# EasyEDA Pro project mykeyboard.epro

# Schematic Schematic1

## Sheets
1 P1: Board Name: Board1; Create Date: 2025-10-04; Page Name: P1; Project Name: mykeyboard; Schematic Name: Schematic1; Update Date: 2025-10-05; Company: 嘉立创EDA; Page Size: A4; Version: V1.0
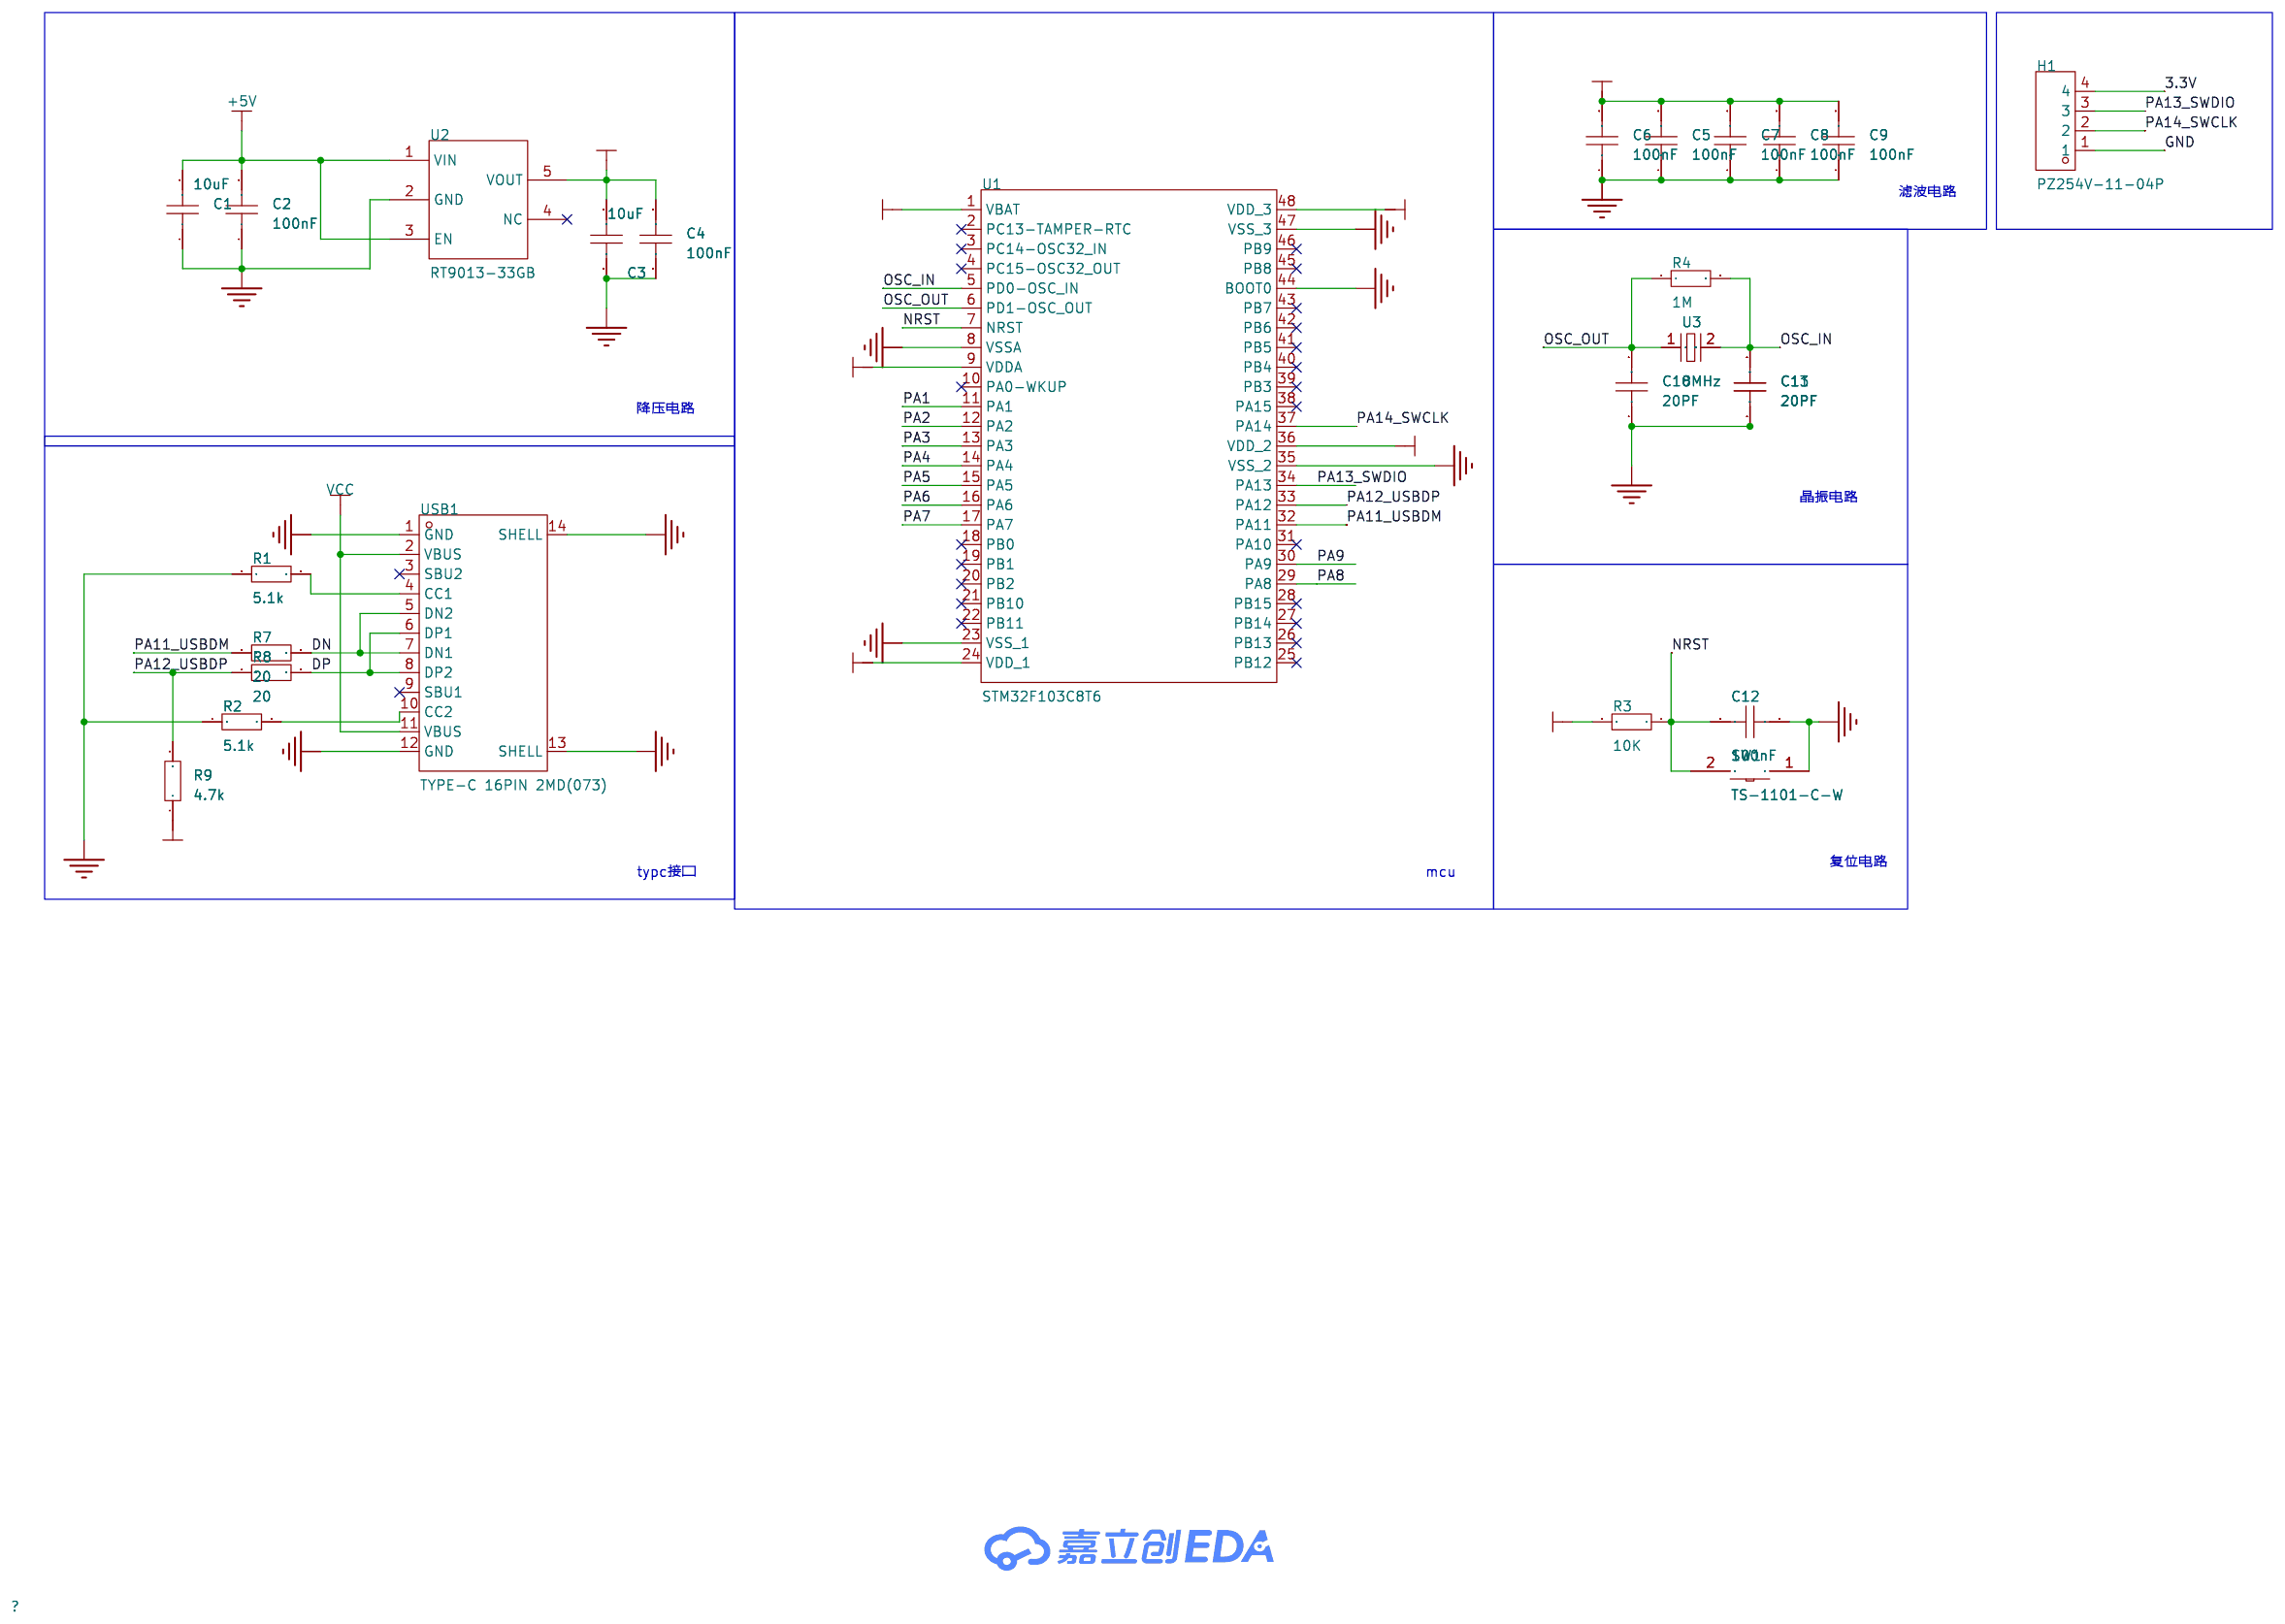
[diagram p0: P1]
2 P2: Create Date: 2025-10-05; Page Name: P2
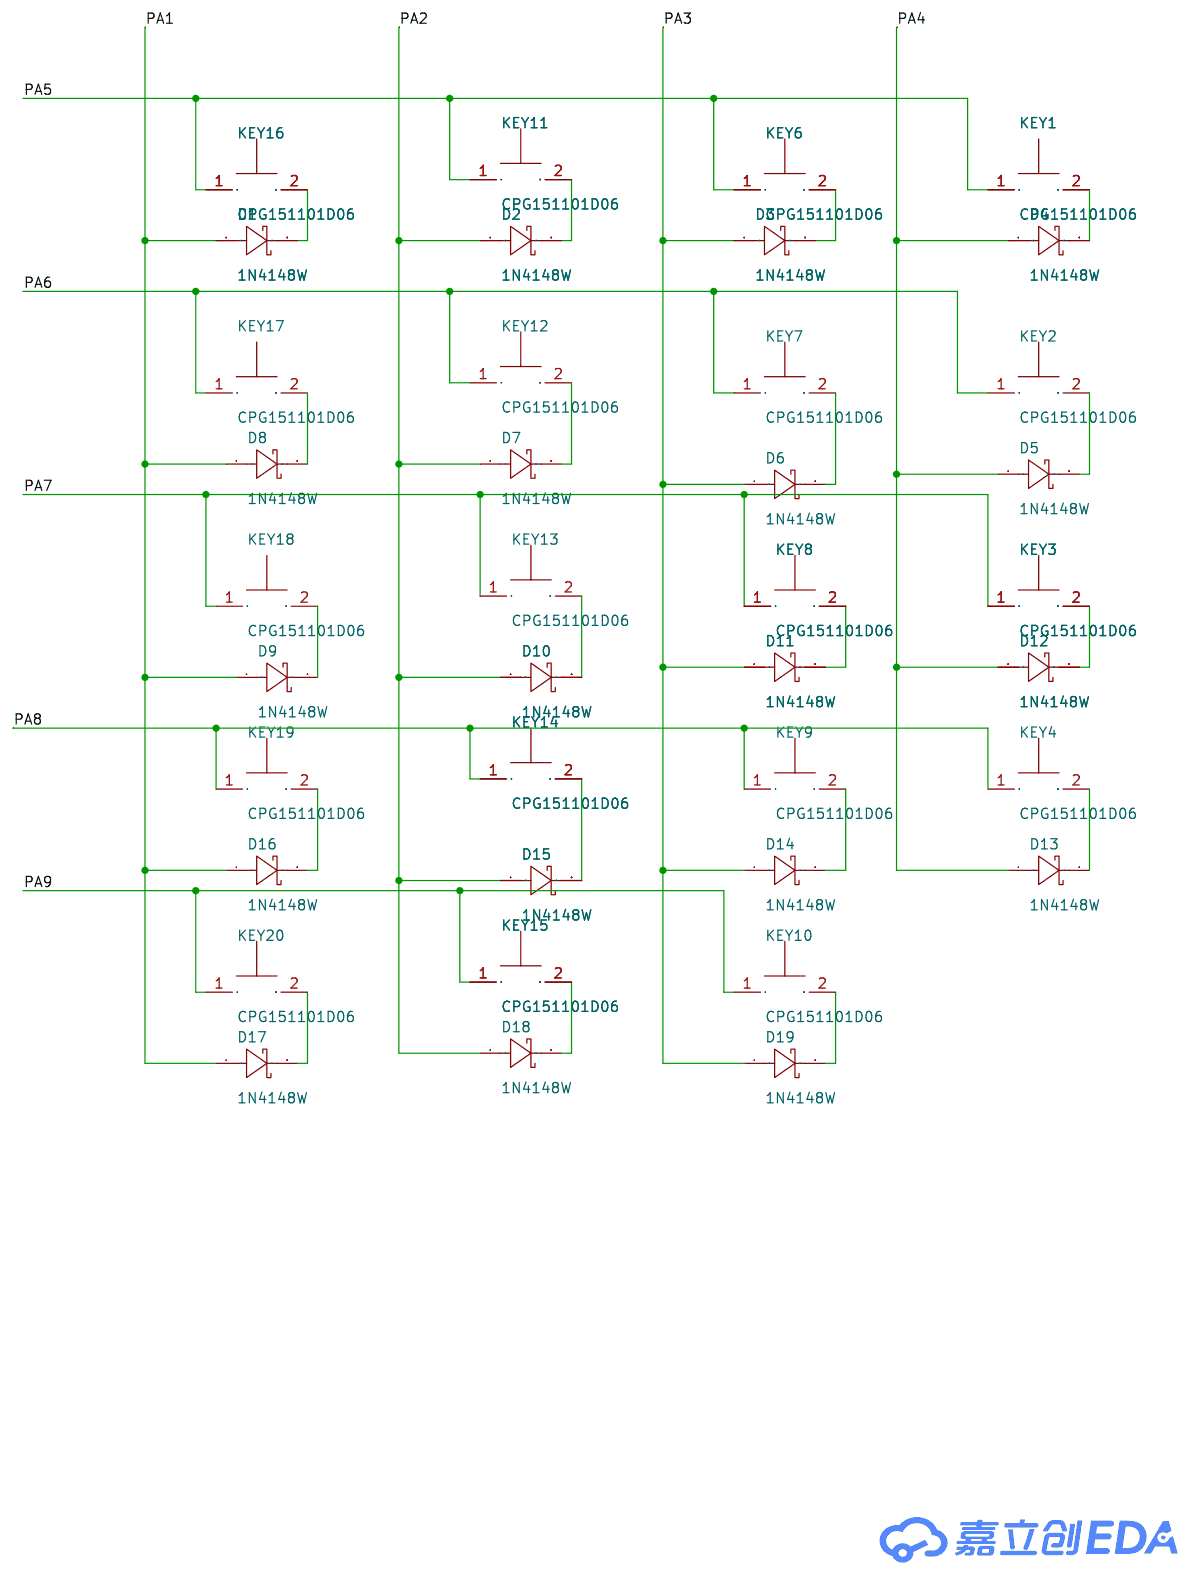
[diagram p1: P2]

## Parts
sheet P1
C1  10uF  [C0603]
C2  100nF  [C0603]
C3  10uF  [C0603]
C4  100nF  [C0603]
C5  100nF  [C0603]
C6  100nF  [C0603]
C7  100nF  [C0603]
C8  100nF  [C0603]
C9  100nF  [C0603]
C10  20PF  [C0603]
C11  20PF  [C0603]
C12  100nF  [C0603]
C13  20PF  [C0603]
H1  PZ254V-11-04P  [HDR-TH_4P-P2.54-V-M]
R1  5.1k  [R0603]
R2  5.1k  [R0603]
R3  10K  [R0603]
R4  1M  [R0603]
R7  20  [R0603]
R8  20  [R0603]
R9  4.7k  [R0603]
SW1  TS-1101-C-W  [SW-SMD_L6.0-W3.3-LS8.0]
U1  STM32F103C8T6  [LQFP-48_L7.0-W7.0-P0.50-LS9.0-BL]
U2  RT9013-33GB  [SOT-23-5_L3.0-W1.7-P0.95-LS2.8-BL]
U3  8MHz  [HC-49S_L7.0-W4.0]
USB1  TYPE-C 16PIN 2MD(073)  [USB-C-SMD_TYPE-C-6PIN-2MD-073]
sheet P2
D1  1N4148W  [SOD-123_L2.7-W1.6-LS3.7-FD]
D2  1N4148W  [SOD-123_L2.7-W1.6-LS3.7-FD]
D3  1N4148W  [SOD-123_L2.7-W1.6-LS3.7-FD]
D4  1N4148W  [SOD-123_L2.7-W1.6-LS3.7-FD]
D5  1N4148W  [SOD-123_L2.7-W1.6-LS3.7-FD]
D6  1N4148W  [SOD-123_L2.7-W1.6-LS3.7-FD]
D7  1N4148W  [SOD-123_L2.7-W1.6-LS3.7-FD]
D8  1N4148W  [SOD-123_L2.7-W1.6-LS3.7-FD]
D9  1N4148W  [SOD-123_L2.7-W1.6-LS3.7-FD]
D10  1N4148W  [SOD-123_L2.7-W1.6-LS3.7-FD]
D11  1N4148W  [SOD-123_L2.7-W1.6-LS3.7-FD]
D12  1N4148W  [SOD-123_L2.7-W1.6-LS3.7-FD]
D13  1N4148W  [SOD-123_L2.7-W1.6-LS3.7-FD]
D14  1N4148W  [SOD-123_L2.7-W1.6-LS3.7-FD]
D15  1N4148W  [SOD-123_L2.7-W1.6-LS3.7-FD]
D16  1N4148W  [SOD-123_L2.7-W1.6-LS3.7-FD]
D17  1N4148W  [SOD-123_L2.7-W1.6-LS3.7-FD]
D18  1N4148W  [SOD-123_L2.7-W1.6-LS3.7-FD]
D19  1N4148W  [SOD-123_L2.7-W1.6-LS3.7-FD]
KEY1  CPG151101D06  [KEY-TH_CPG151101D06]
KEY2  CPG151101D06  [KEY-TH_CPG151101D06]
KEY3  CPG151101D06  [KEY-TH_CPG151101D06]
KEY4  CPG151101D06  [KEY-TH_CPG151101D06]
KEY6  CPG151101D06  [KEY-TH_CPG151101D06]
KEY7  CPG151101D06  [KEY-TH_CPG151101D06]
KEY8  CPG151101D06  [KEY-TH_CPG151101D06]
KEY9  CPG151101D06  [KEY-TH_CPG151101D06]
KEY10  CPG151101D06  [KEY-TH_CPG151101D06]
KEY11  CPG151101D06  [KEY-TH_CPG151101D06]
KEY12  CPG151101D06  [KEY-TH_CPG151101D06]
KEY13  CPG151101D06  [KEY-TH_CPG151101D06]
KEY14  CPG151101D06  [KEY-TH_CPG151101D06]
KEY15  CPG151101D06  [KEY-TH_CPG151101D06]
KEY16  CPG151101D06  [KEY-TH_CPG151101D06]
KEY17  CPG151101D06  [KEY-TH_CPG151101D06]
KEY18  CPG151101D06  [KEY-TH_CPG151101D06]
KEY19  CPG151101D06  [KEY-TH_CPG151101D06]
KEY20  CPG151101D06  [KEY-TH_CPG151101D06]

## Library data of the parts
C1-C13 = CAP_0603: Supplier Footprint: 0603
H1 = PZ254V-11-04P: 插针结构:1x4P;间距:2.54mm;行距:-;圆针/方针:方针;安装方式:直插;排数:单排;总PIN位数:4P;额定电流:3A;额定电压:250V;配合针长度:6mm;塑高:2.5mm;端接针长度:3mm;触头材质:-;工作温度:-40℃~+105℃;颜色:黑色;; LCSC Part Name: 1x4P 间距:2.54mm 方针 直插; Supplier Part: C2691448; Manufacturer: XFCN(兴飞); Supplier Footprint: 插件,P=2.54mm; JLCPCB Part Class: 扩展库; Datasheet: https://item.szlcsc.com/datasheet/PZ254V-11-04P/2801085.html; Supplier: LCSC; Pin Structure: 1x4P; Pitch: 2.54mm; Circluar Pins/Square Pins: 方针; Mounting Type: 直插; Number of Rows: 单排; Number of Pins: 4P; Current Rating: 3A; Voltage Rating (Max): 250V; Length of Mating Pin: 6mm; Insulation Height: 2.5mm; Length of End Connection Pin: 3mm; Operating Temperature: -40℃~+105℃; Color: 黑色
R1-R4 R7-R9 = Res_0603: Supplier Footprint: 0603
SW1 = TS-1101-C-W: 电路结构:单刀单掷;按钮形状:矩形按钮;作用力:260gf;安装方式:立贴;开关长度:6mm;开关宽度:3.6mm;开关高度:2.5mm;带支架:不带;触点电流:50mA;额定电压(AC):-;额定电压(DC):12V;额定功率:-;绝缘电阻:-;带灯:无;机械寿命:5万次;; LCSC Part Name: 6*3.6*2.5mm 立贴 轻触开关; Supplier Part: C318938; Manufacturer: XKB Connectivity(中国星坤); Supplier Footprint: SMD; JLCPCB Part Class: 扩展库; Datasheet: https://atta.szlcsc.com/upload/public/pdf/source/20200227/C318938_C2E53B1EEDE37D980A33616AC086DE53.pdf; Supplier: LCSC; Circuit: 单刀单掷; Actuator Style: 矩形按钮; Operating Force: 260gf; Mounting Style: 立贴; Switch Length: 6mm; Switch Width: 3.6mm; Switch Height: 2.5mm; Strike Gundam: 不带; Contact Current: 50mA; Voltage Rating (DC): 12V; Actuator/Cap Color: 白色带淡绿; With Lamp: 无; Mechanical Life: 5万次; Operating Temperature: -30℃~+85℃
U1 = STM32F103C8T6: CPU内核:ARM-M3;CPU最大主频:72MHz;应用领域:-;; LCSC Part Name: 主流增强型ARM Cortex-M3 MCU，具有64 KB Flash、72 MHz CPU、电机控制、USB和CAN; Supplier Part: C8734; Manufacturer: ST(意法半导体); Supplier Footprint: LQFP-48(7x7); JLCPCB Part Class: 扩展库; Datasheet: https://item.szlcsc.com/datasheet/STM32F103C8T6/9243.html; Supplier: LCSC; CPU Core: ARM-M3; CPU Maximum Speed: 72MHz; Program Storage Size: 64KB; Program Memory Type: FLASH; Number of I/O: 37; ADC (Bit): 12bit; Voltage - Supply: 2V~3.6V
U2 = RT9013-33GB: 输出类型:固定;工作电压:5.5V;输出电压:3.3V;输出电流:500mA;电源纹波抑制比(PSRR):50dB@(10kHz);输出极性:正极;; LCSC Part Name: 输入5.5V 输出3.3V 500mA; Supplier Part: C47773; Manufacturer: RICHTEK(立锜); Supplier Footprint: SOT-23-5; JLCPCB Part Class: 扩展库; Datasheet: https://item.szlcsc.com/datasheet/RT9013-33GB/48778.html; Supplier: LCSC; Output Type: 固定; Voltage - Supply: 5.5V; Output Voltage: 3.3V; Output Current: 500mA; Power Supply Rejection Ratio (PSRR): 50dB@(10kHz); Voltage Dropout: 400mV@(500mA); standby current: 25uA; Noise: 30uVrms; Features: 带使能；过热保护；过流保护; Operating Temperature: -40℃~+125℃@(Tj); Output Configuration: 正极; Number of Outputs: 1
U3 = 8M 20PF 20PPM: 频率:8MHz;常温频差:±20ppm;负载电容:20pF;频率稳定度:±30ppm;; LCSC Part Name: 8MHz ±20ppm 20pF; Supplier Part: C5289692; Manufacturer: SOSET(索斯特); Supplier Footprint: HC-49S-SMD-Mini; JLCPCB Part Class: 扩展库; Datasheet: https://item.szlcsc.com/datasheet/8M%252020PF%252020PPM/6029008.html; Supplier: LCSC; Normal temperature Frequency Tolerance: ±20ppm; Load Capacitance: 20pF; Frequency Stability: ±30ppm; Operating Temperature: -20℃~+70℃
USB1 = TYPE-C 16PIN 2MD(073): 连接器类型:Type-C;协议标准:-;公母:母;安装方式:卧贴;触点数量:16P;端口数量:1;额定电流 - 电源:3A;工作温度:-25℃~+85℃;; LCSC Part Name: Type-C 母 卧贴; Supplier Part: C2765186; Manufacturer: SHOU HAN(首韩); Supplier Footprint: SMD; JLCPCB Part Class: 扩展库; Datasheet: https://item.szlcsc.com/datasheet/TYPE-C%252016PIN%25202MD(073)/2901843.html; Supplier: LCSC; Connector Type: Type-C; Gender: 母; Mounting Type: 卧贴; Number of Contacts: 16P; Number of Ports: 1; Current Rating-Power: 3A; Voltage Rating: 5V; Connect-Disconnect Life: 5千次; Detection color: 黑色; Operating Temperature: -25℃~+85℃
D1-D19 = 1N4148W_C7420318: 二极管配置:独立式;正向压降(Vf):1.25V@150mA;直流反向耐压(Vr):100V;整流电流:150mA;反向恢复时间(Trr):4ns;; Supplier Part: C7420318; Manufacturer: R+O(宏嘉诚); Supplier Footprint: SOD-123; JLCPCB Part Class: 扩展库; Datasheet: https://item.szlcsc.com/datasheet/1N4148W/8397140.html; Supplier: LCSC; Diode Configuration: 独立式; Voltage - Forward(Vf@If): 1.25V@150mA; Voltage - DC Reverse(Vr): 100V; Current - Rectified: 150mA; Pd - Power Dissipation: 400mW; Reverse Leakage Current (Ir): 1uA@75V; Reverse Recovery Time (trr): 4ns; Operating Junction Temperature Range: -55℃~+150℃; Non-Repetitive Peak Forward Surge Current: 2A
KEY1-KEY4 KEY6-KEY20 = CPG151101D06: 机械键盘开关MX茶轴 段落手感; Supplier Part: C49234237; Manufacturer: HanElectricity(瀚源); Supplier Footprint: 插件; JLCPCB Part Class: 扩展库; Datasheet: https://atta.szlcsc.com/upload/public/pdf/source/20250618/1ECA712F36A194FE51736216F4B8819D.pdf; Supplier: LCSC

## Nets
3.3V: C3.2 C4.2 C5.2 C6.2 C7.2 C8.2 C9.2 H1.4 R3.2 R9.1 U1.1(VBAT) U1.9(VDDA) U1.24(VDD_1) U1.36(VDD_2) U1.48(VDD_3) U2.5(VOUT)
+5V: C1.2 C2.2 U2.1(VIN) U2.3(EN)
GND: C1.1 C2.1 C3.1 C4.1 C5.1 C6.1 C7.1 C8.1 C9.1 C10.1 C11.1 C12.1 C13.1 H1.1 R1.1 R2.1 SW1.1 U1.8(VSSA) U1.23(VSS_1) U1.35(VSS_2) U1.44(BOOT0) U1.47(VSS_3) U2.2(GND) USB1.1(GND) USB1.12(GND) USB1.13(SHELL) USB1.14(SHELL)
VCC: USB1.2(VBUS) USB1.11(VBUS)
DN: R7.2 USB1.5(DN2) USB1.7(DN1)
DP: R8.2 USB1.6(DP1) USB1.8(DP2)
NRST: C12.2 R3.1 SW1.2 U1.7(NRST)
OSC_IN: C11.2 C13.2 R4.2 U1.5(PD0-OSC_IN) U3.2(GND)
OSC_OUT: C10.2 R4.1 U1.6(PD1-OSC_OUT) U3.1
PA1: D1.1(A) D8.1(A) D9.1(A) D16.1(A) D17.1(A) U1.11(PA1)
PA2: D2.1(A) D7.1(A) D10.1(A) D15.1(A) D18.1(A) U1.12(PA2)
PA3: D3.1(A) D6.1(A) D11.1(A) D14.1(A) D19.1(A) U1.13(PA3)
PA4: D4.1(A) D5.1(A) D12.1(A) D13.1(A) U1.14(PA4)
PA5: KEY1.1 KEY6.1 KEY11.1 KEY16.1 U1.15(PA5)
PA6: KEY2.1 KEY7.1 KEY12.1 KEY17.1 U1.16(PA6)
PA7: KEY3.1 KEY8.1 KEY13.1 KEY18.1 U1.17(PA7)
PA8: KEY4.1 KEY9.1 KEY14.1 KEY19.1 U1.29(PA8)
PA9: KEY10.1 KEY15.1 KEY20.1 U1.30(PA9)
PA11_USBDM: R7.1 U1.32(PA11)
PA12_USBDP: R8.1 R9.2 U1.33(PA12)
PA13_SWDIO: H1.3 U1.34(PA13)
PA14_SWCLK: H1.2 U1.37(PA14)
$1N879: R2.2 USB1.10(CC2)
$1N949: R1.2 USB1.4(CC1)
$2N2321: D1.2(K) KEY16.2
$2N2416: D8.2(K) KEY17.2
$2N2432: D7.2(K) KEY12.2
$2N2438: D2.2(K) KEY11.2
$2N2444: D3.2(K) KEY6.2
$2N2450: D4.2(K) KEY1.2
$2N2455: D5.2(K) KEY2.2
$2N2482: D6.2(K) KEY7.2
$2N2538: D9.2(K) KEY18.2
$2N2571: D10.2(K) KEY13.2
$2N2603: D11.2(K) KEY8.2
$2N2624: D12.2(K) KEY3.2
$2N2648: D13.2(K) KEY4.2
$2N2677: D14.2(K) KEY9.2
$2N2714: D15.2(K) KEY14.2
$2N2748: D16.2(K) KEY19.2
$2N2794: D19.2(K) KEY10.2
$2N2817: D18.2(K) KEY15.2
$2N2829: D17.2(K) KEY20.2

Not connected (* = marked no-connect by the designer): U1 2(PC13-TAMPER-RTC)* 3(PC14-OSC32_IN)* 4(PC15-OSC32_OUT)* 10(PA0-WKUP)* 18(PB0)* 19(PB1)* 20(PB2)* 21(PB10)* 22(PB11)* 25(PB12)* 26(PB13)* 27(PB14)* 28(PB15)* 31(PA10)* 38(PA15)* 39(PB3)* 40(PB4)* 41(PB5)* 42(PB6)* 43(PB7)* 45(PB8)* 46(PB9)*; U2 4(NC)*; USB1 3(SBU2)* 9(SBU1)*

## Notes on the sheets
sheet 1
- 滤波电路
- 降压电路
- 晶振电路
- typc接口
- mcu
- 复位电路

# Board PCB4
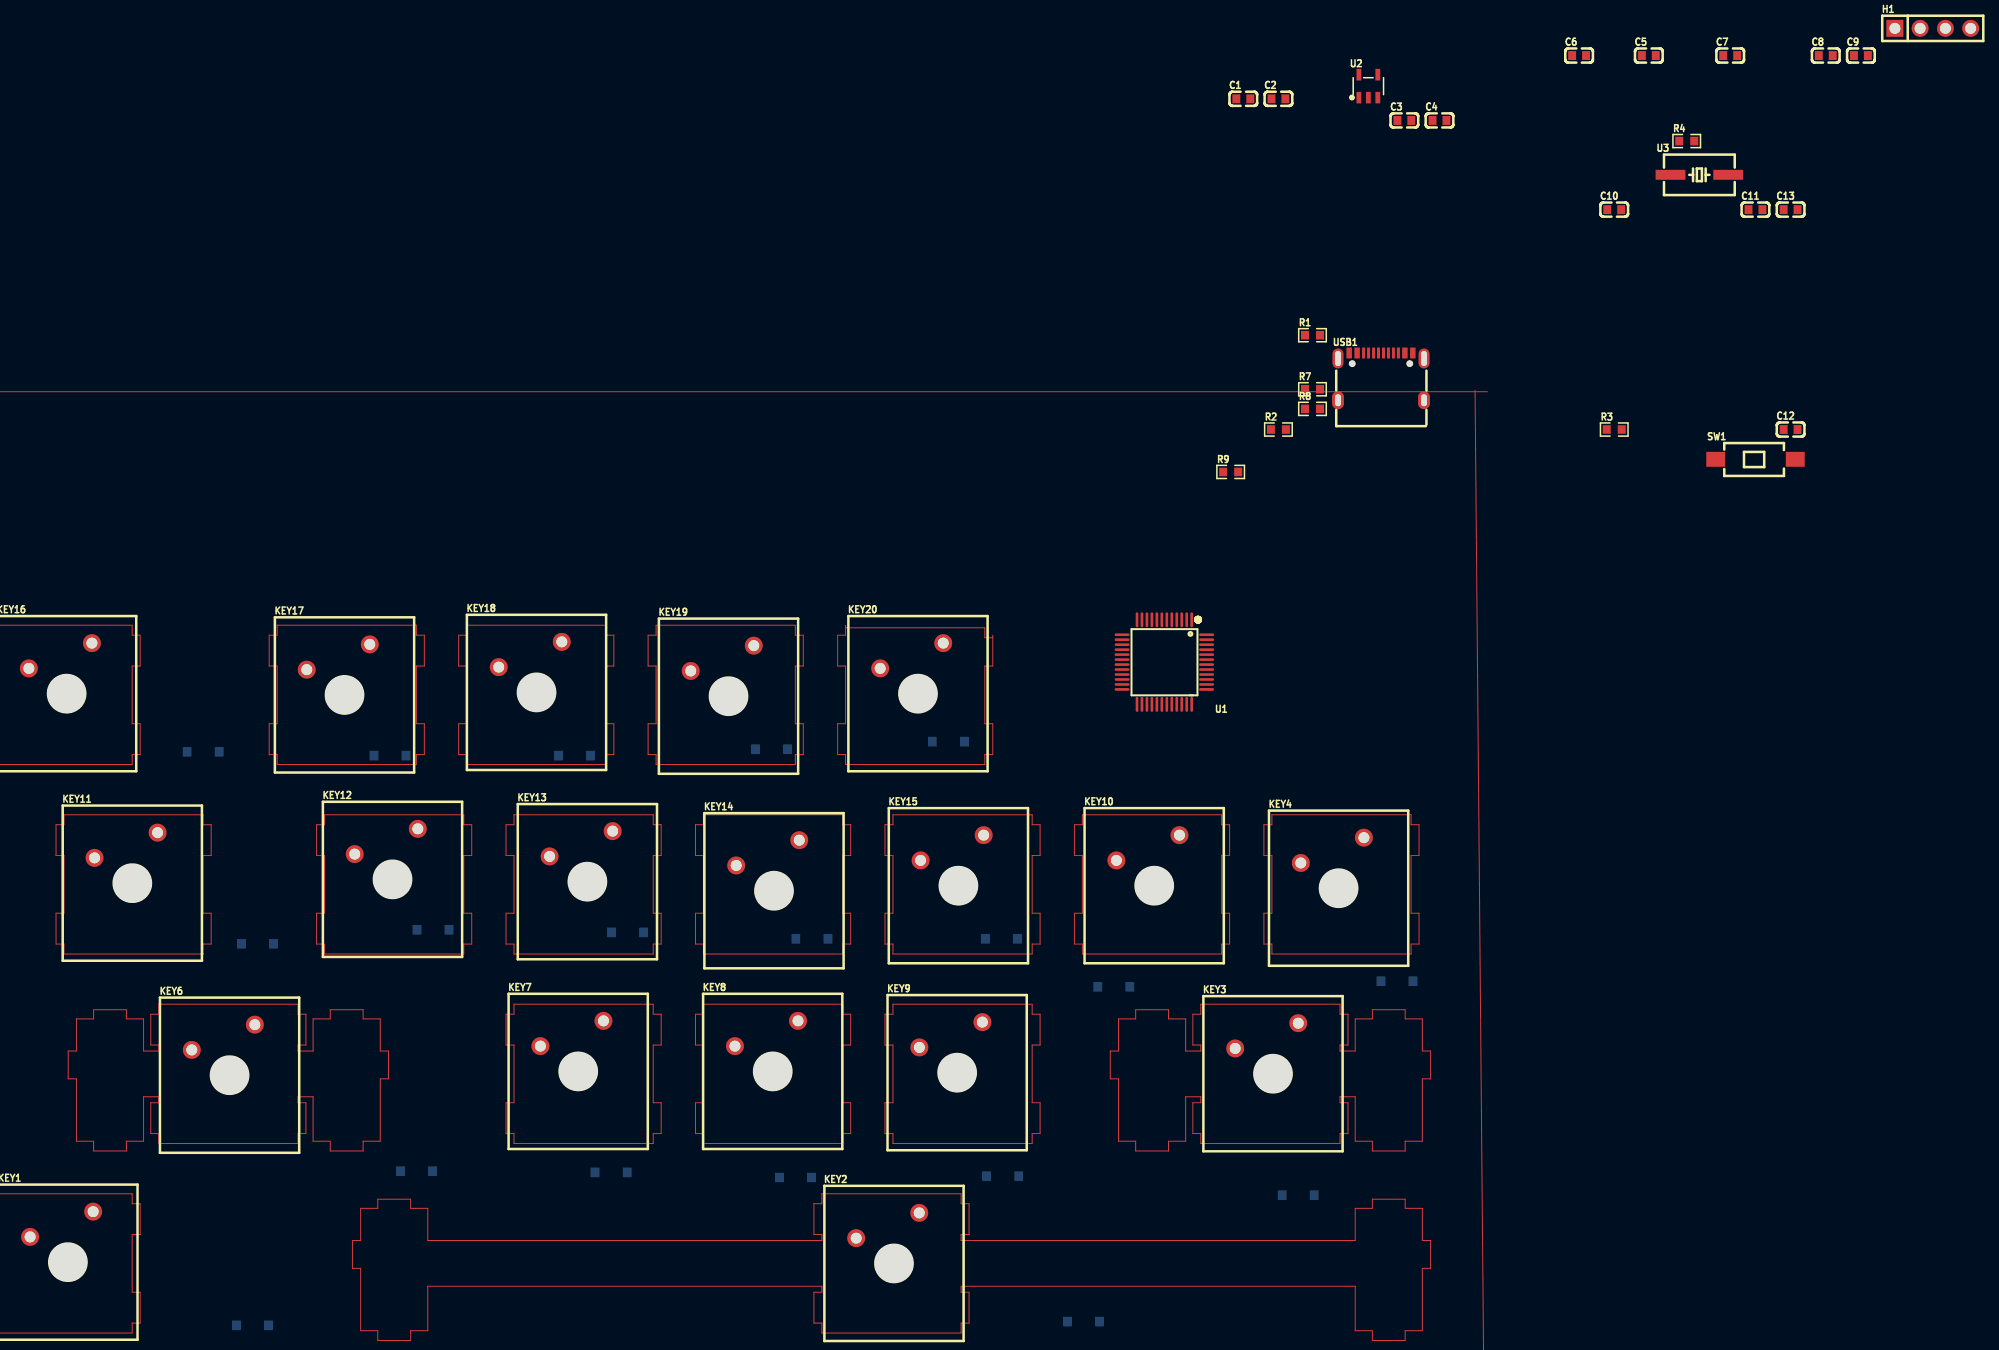
[diagram p2: board, top side]
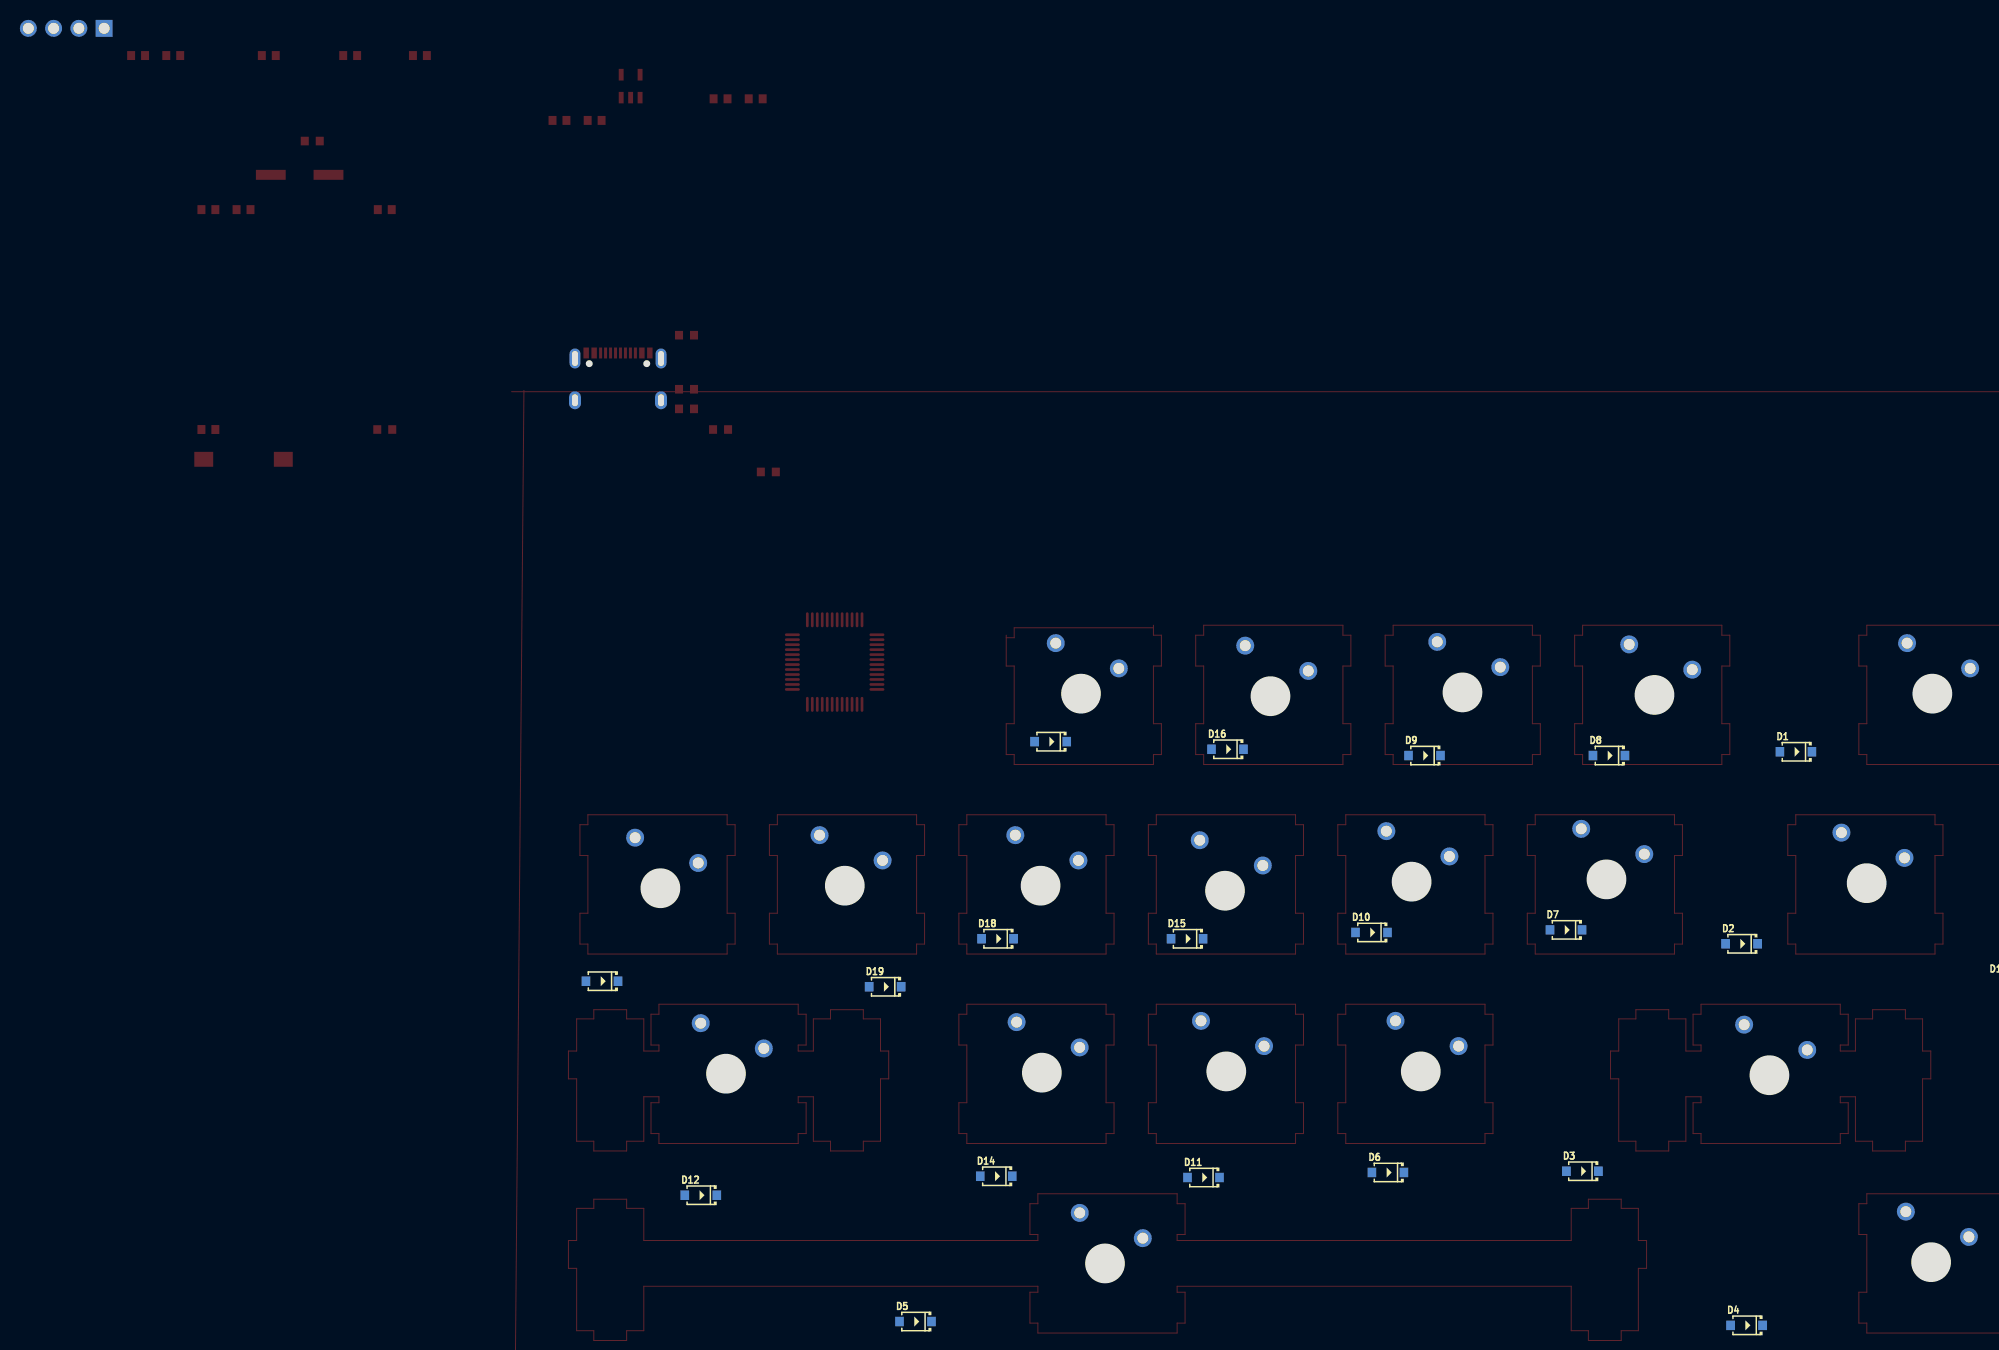
[diagram p3: board, bottom side, seen from below]

Outline 137.38 x 92.8 mm; copper layers: Top Layer, Bottom Layer. Coordinates in mm from the lower left corner of the outline.
Stack: Top Layer 0.035mm / Dielectric1 1.51mm FR4 er 4.5 / Bottom Layer 0.035mm

## Design rules (mm)
template: JLCPCB Capability(Two Layers Board)
spacing copperThickness1oz (default): track to track 0.102, other pairs 0.152 to 0.3
spacing copperThickness2oz: track to track 0.203, other pairs 0.152 to 0.3
track width copperThickness1oz (default): min 0.127, default 0.254, max 2.54
track width copperThickness2oz: min 0.203, default 0.254, max 2.54
differential pair differentialPair (default): width min 0.127, default 0.254, max 2.54; gap min 0.152, default 0.152
via viaSize (default): diameter min 0.5, default 0.61, max 10; hole min 0.3, default 0.305, max 6.3

## Placement (name value [footprint] x y rotation side)
C1  10uF  [C0603]  120.3 119.07 0 top
C2  100nF  [C0603]  123.84 119.07 0 top
C3  10uF  [C0603]  136.5 116.9 0 top
C4  100nF  [C0603]  140.03 116.9 0 top
C5  100nF  [C0603]  161.08 123.42 0 top
C6  100nF  [C0603]  154.06 123.42 0 top
C7  100nF  [C0603]  169.26 123.42 0 top
C8  100nF  [C0603]  178.87 123.42 0 top
C9  100nF  [C0603]  182.4 123.42 0 top
C10  20PF  [C0603]  157.6 107.93 0 top
C11  20PF  [C0603]  171.8 107.93 0 top
C12  100nF  [C0603]  175.33 85.83 0 top
C13  20PF  [C0603]  175.33 107.93 0 top
D1  1N4148W  [SOD-123_L2.7-W1.6-LS3.7-FD]  15.72 53.43 180 bottom
D2  1N4148W  [SOD-123_L2.7-W1.6-LS3.7-FD]  21.18 34.13 180 bottom
D3  1N4148W  [SOD-123_L2.7-W1.6-LS3.7-FD]  37.18 11.27 180 bottom
D4  1N4148W  [SOD-123_L2.7-W1.6-LS3.7-FD]  20.67 -4.23 180 bottom
D5  1N4148W  [SOD-123_L2.7-W1.6-LS3.7-FD]  104.24 -3.85 180 bottom
D6  1N4148W  [SOD-123_L2.7-W1.6-LS3.7-FD]  56.74 11.14 180 bottom
D7  1N4148W  [SOD-123_L2.7-W1.6-LS3.7-FD]  38.83 35.52 180 bottom
D8  1N4148W  [SOD-123_L2.7-W1.6-LS3.7-FD]  34.51 53.05 180 bottom
D9  1N4148W  [SOD-123_L2.7-W1.6-LS3.7-FD]  53.05 53.05 180 bottom
D10  1N4148W  [SOD-123_L2.7-W1.6-LS3.7-FD]  58.39 35.27 180 bottom
D11  1N4148W  [SOD-123_L2.7-W1.6-LS3.7-FD]  75.28 10.63 180 bottom
D12  1N4148W  [SOD-123_L2.7-W1.6-LS3.7-FD]  125.83 8.85 180 bottom
D13  1N4148W  [SOD-123_L2.7-W1.6-LS3.7-FD]  135.76 30.37 180 bottom
D14  1N4148W  [SOD-123_L2.7-W1.6-LS3.7-FD]  96.11 10.76 180 bottom
D15  1N4148W  [SOD-123_L2.7-W1.6-LS3.7-FD]  76.93 34.63 180 bottom
D16  1N4148W  [SOD-123_L2.7-W1.6-LS3.7-FD]  72.87 53.68 180 bottom
D17  1N4148W  [SOD-123_L2.7-W1.6-LS3.7-FD]  90.65 54.45 180 bottom
D18  1N4148W  [SOD-123_L2.7-W1.6-LS3.7-FD]  95.98 34.63 180 bottom
D19  1N4148W  [SOD-123_L2.7-W1.6-LS3.7-FD]  107.28 29.81 180 bottom
H1  PZ254V-11-04P  [HDR-TH_4P-P2.54-V-M]  189.62 126.15 0 top
KEY1  CPG151101D06  [KEY-TH_CPG151101D06]  1.49 5.93 0 top
KEY2  CPG151101D06  [KEY-TH_CPG151101D06]  84.55 5.81 0 top
KEY3  CPG151101D06  [KEY-TH_CPG151101D06]  122.66 24.88 0 top
KEY4  CPG151101D06  [KEY-TH_CPG151101D06]  129.25 43.52 0 top
KEY6  CPG151101D06  [KEY-TH_CPG151101D06]  17.75 24.73 0 top
KEY7  CPG151101D06  [KEY-TH_CPG151101D06]  52.8 25.11 0 top
KEY8  CPG151101D06  [KEY-TH_CPG151101D06]  72.36 25.11 0 top
KEY9  CPG151101D06  [KEY-TH_CPG151101D06]  90.9 24.98 0 top
KEY10  CPG151101D06  [KEY-TH_CPG151101D06]  110.71 43.78 0 top
KEY11  CPG151101D06  [KEY-TH_CPG151101D06]  7.97 44.03 0 top
KEY12  CPG151101D06  [KEY-TH_CPG151101D06]  34.13 44.41 0 top
KEY13  CPG151101D06  [KEY-TH_CPG151101D06]  53.72 44.18 0 top
KEY14  CPG151101D06  [KEY-TH_CPG151101D06]  72.49 43.27 0 top
KEY15  CPG151101D06  [KEY-TH_CPG151101D06]  91.03 43.78 0 top
KEY16  CPG151101D06  [KEY-TH_CPG151101D06]  1.37 63.08 0 top
KEY17  CPG151101D06  [KEY-TH_CPG151101D06]  29.31 62.96 0 top
KEY18  CPG151101D06  [KEY-TH_CPG151101D06]  48.61 63.21 0 top
KEY19  CPG151101D06  [KEY-TH_CPG151101D06]  67.91 62.83 0 top
KEY20  CPG151101D06  [KEY-TH_CPG151101D06]  86.96 63.08 0 top
R1  5.1k  [R0603]  127.26 95.31 0 top
R2  5.1k  [R0603]  123.84 85.83 0 top
R3  10K  [R0603]  157.6 85.83 0 top
R4  1M  [R0603]  164.89 114.82 0 top
R7  20  [R0603]  127.26 89.87 0 top
R8  20  [R0603]  127.26 87.9 0 top
R9  4.7k  [R0603]  119.03 81.56 0 top
SW1  TS-1101-C-W  [SW-SMD_L6.0-W3.3-LS8.0]  171.8 82.83 0 top
U1  STM32F103C8T6  [LQFP-48_L7.0-W7.0-P0.50-LS9.0-BL]  112.36 62.45 180 top
U2  RT9013-33GB  [SOT-23-5_L3.0-W1.7-P0.95-LS2.8-BL]  132.88 120.34 0 top
U3  8MHz  [HC-49S_L7.0-W4.0]  166.16 111.43 0 top
USB1  TYPE-C 16PIN 2MD(073)  [USB-C-SMD_TYPE-C-6PIN-2MD-073]  134.15 91.14 0 top

## Footprints (pads in the part's own frame, mm; a bottom-side part is the same pattern mirrored in y, then rotated)
C0603
  rect 0.8x0.9 smd: 1(-0.7,0) 2(0.7,0)
HC-49S_L7.0-W4.0
  rect 3x1 smd: 1(-2.9,0) 2(2.9,0)
HDR-TH_4P-P2.54-V-M
  rect 1.7x1.7 hole 1.1: 1(-3.81,0)
  round 1.7 hole 1.1: 2(-1.27,0) 3(1.27,0) 4(3.81,0)
KEY-TH_CPG151101D06
  round 1.8 hole 1.1: 1(-3.17,-1.27) 2(3.17,1.27)
LQFP-48_L7.0-W7.0-P0.50-LS9.0-BL
  oval 0.27x1.5 smd: 1(-2.75,-4.25) 2(-2.25,-4.25) 3(-1.75,-4.25) 4(-1.25,-4.25) 5(-0.75,-4.25) 6(-0.25,-4.25) 7(0.25,-4.25) 8(0.75,-4.25) 9(1.25,-4.25) 10(1.75,-4.25) 11(2.25,-4.25) 12(2.75,-4.25) 25(2.75,4.25) 26(2.25,4.25) 27(1.75,4.25) 28(1.25,4.25) 29(0.75,4.25) 30(0.25,4.25) 31(-0.25,4.25) 32(-0.75,4.25) 33(-1.25,4.25) 34(-1.75,4.25) 35(-2.25,4.25) 36(-2.75,4.25)
  oval 1.5x0.27 smd: 13(4.25,-2.75) 14(4.25,-2.25) 15(4.25,-1.75) 16(4.25,-1.25) 17(4.25,-0.75) 18(4.25,-0.25) 19(4.25,0.25) 20(4.25,0.75) 21(4.25,1.25) 22(4.25,1.75) 23(4.25,2.25) 24(4.25,2.75) 37(-4.25,2.75) 38(-4.25,2.25) 39(-4.25,1.75) 40(-4.25,1.25) 41(-4.25,0.75) 42(-4.25,0.25) 43(-4.25,-0.25) 44(-4.25,-0.75) 45(-4.25,-1.25) 46(-4.25,-1.75) 47(-4.25,-2.25) 48(-4.25,-2.75)
R0603
  rect 0.806x0.864 smd: 1(-0.753,0) 2(0.753,0)
SOD-123_L2.7-W1.6-LS3.7-FD
  rect 0.88x0.96 smd: 1(-1.61,0) 2(1.61,0)
SOT-23-5_L3.0-W1.7-P0.95-LS2.8-BL
  rect 0.49x1.157 smd: 1(-0.95,-1.153) 2(0,-1.153) 3(0.95,-1.153)
  rect 0.49x1.175 smd: 4(0.95,1.153) 5(-0.95,1.153)
SW-SMD_L6.0-W3.3-LS8.0
  rect 1.9x1.5 smd: 1(-4,0) 2(4,0)
USB-C-SMD_TYPE-C-6PIN-2MD-073
  rect 0.55x1.1 smd: 1(-3.2,2.375) 2(-2.4,2.375) 11(2.4,2.375) 12(3.2,2.375)
  rect 0.3x1.1 smd: 3(-1.75,2.375) 4(-1.25,2.375) 5(-0.75,2.375) 6(-0.25,2.375) 7(0.25,2.375) 8(0.75,2.375) 9(1.25,2.375) 10(1.75,2.375)
  oval 1.1x2 hole 0.6x1.5: 13(-4.325,1.825) 14(4.325,1.825)
  oval 1.2x1.8 hole 0.6x1.2: 13(-4.325,-2.375) 14(4.325,-2.375)

## Nets
As in the schematic.

Pads without a net: U1 2 3 4 10 18 19 20 21 22 25 26 27 28 31 38 39 40 41 42 43 45 46; U2 4; USB1 3 9
